# Altium schematic sheet optrons_and_mcp.SchDoc
size A3
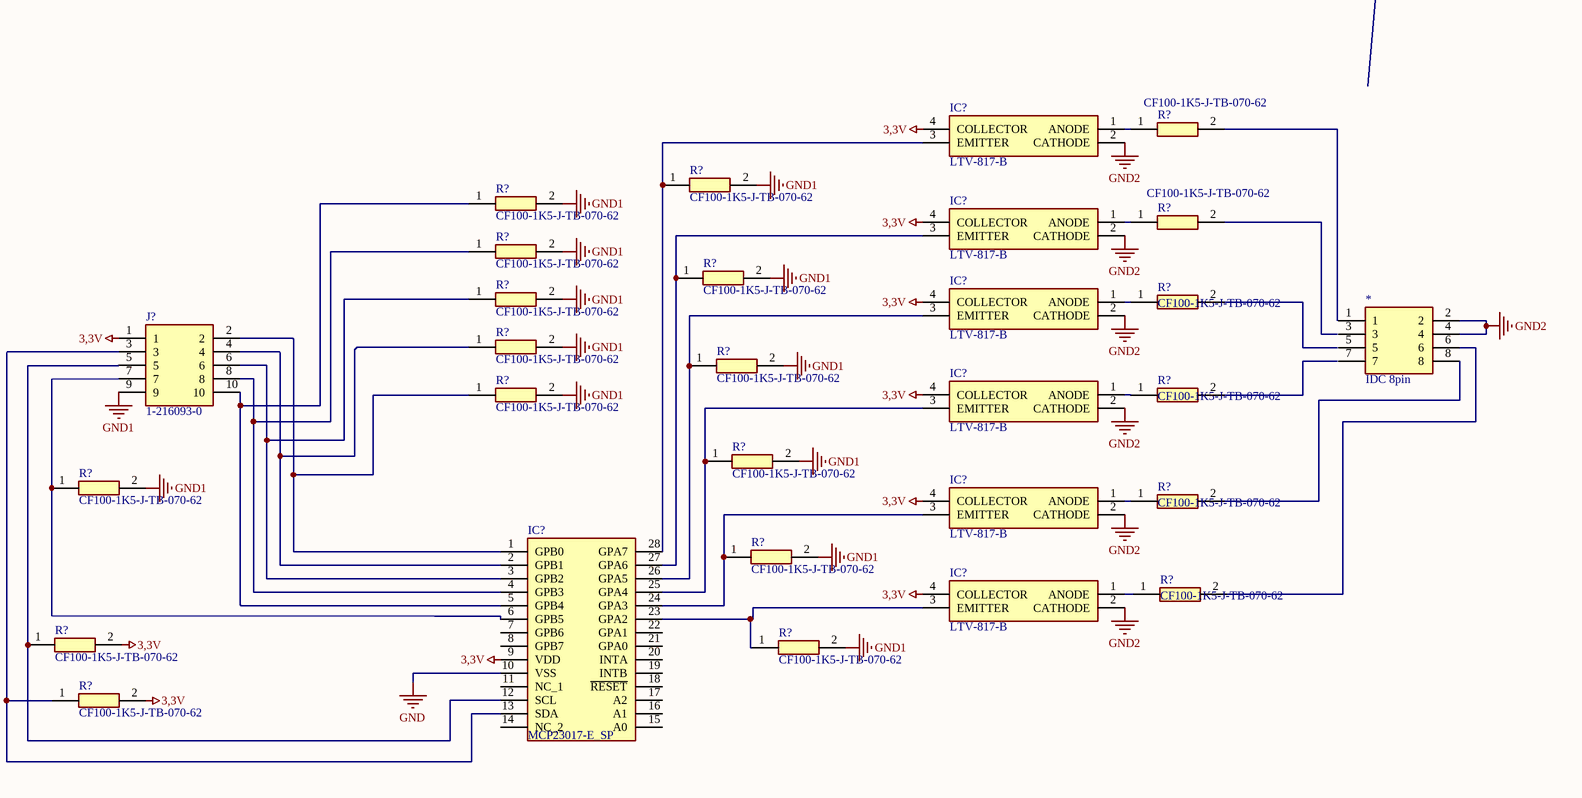
[diagram p0: optrons_and_mcp.SchDoc, bottom right]

## Parts
(Parts that share a designator on the sheet are numbered #1, #2 ... from top to bottom, then left to right.)
*  IDC 8pin
IC?#1  LTV-817-B  [DIP762W60P254L460H420Q4N]
IC?#2  LTV-817-B  [DIP762W60P254L460H420Q4N]
IC?#3  LTV-817-B  [DIP762W60P254L460H420Q4N]
IC?#4  LTV-817-B  [DIP762W60P254L460H420Q4N]
IC?#5  LTV-817-B  [DIP762W60P254L460H420Q4N]
IC?#6  MCP23017-E_SP  [DIP794W56P254L3486H508Q28N]
IC?#7  LTV-817-B  [DIP762W60P254L460H420Q4N]
J?  1-216093-0  [12160930]
R?#1  CF100-1K5-J-TB-070-62  [RESAD2700W60L1100D400]
R?#2  CF100-1K5-J-TB-070-62  [RESAD2700W60L1100D400]
R?#3  CF100-1K5-J-TB-070-62  [RESAD2700W60L1100D400]
R?#4  CF100-1K5-J-TB-070-62  [RESAD2700W60L1100D400]
R?#5  CF100-1K5-J-TB-070-62  [RESAD2700W60L1100D400]
R?#6  CF100-1K5-J-TB-070-62  [RESAD2700W60L1100D400]
R?#7  CF100-1K5-J-TB-070-62  [RESAD2700W60L1100D400]
R?#8  CF100-1K5-J-TB-070-62  [RESAD2700W60L1100D400]
R?#9  CF100-1K5-J-TB-070-62  [RESAD2700W60L1100D400]
R?#10  CF100-1K5-J-TB-070-62  [RESAD2700W60L1100D400]
R?#11  CF100-1K5-J-TB-070-62  [RESAD2700W60L1100D400]
R?#12  CF100-1K5-J-TB-070-62  [RESAD2700W60L1100D400]
R?#13  CF100-1K5-J-TB-070-62  [RESAD2700W60L1100D400]
R?#14  CF100-1K5-J-TB-070-62  [RESAD2700W60L1100D400]
R?#15  CF100-1K5-J-TB-070-62  [RESAD2700W60L1100D400]
R?#16  CF100-1K5-J-TB-070-62  [RESAD2700W60L1100D400]
R?#17  CF100-1K5-J-TB-070-62  [RESAD2700W60L1100D400]
R?#18  CF100-1K5-J-TB-070-62  [RESAD2700W60L1100D400]
R?#19  CF100-1K5-J-TB-070-62  [RESAD2700W60L1100D400]
R?#20  CF100-1K5-J-TB-070-62  [RESAD2700W60L1100D400]

## Nets
3,3V: IC?#2.4(COLLECTOR) IC?#3.4(COLLECTOR) IC?#4.4(COLLECTOR) IC?#5.4(COLLECTOR) IC?#6.9(VDD) IC?#7.4(COLLECTOR) J?.1 R?#18.2 R?#20.2
GND: IC?#6.10(VSS)
GND1: J?.9 R?#2.2 R?#3.2 R?#5.2 R?#6.2 R?#7.2 R?#9.2 R?#10.2 R?#11.2 R?#13.2 R?#14.2 R?#16.2 R?#19.2
GND2: *.2 *.4 IC?#1.2(CATHODE) IC?#2.2(CATHODE) IC?#3.2(CATHODE) IC?#4.2(CATHODE) IC?#5.2(CATHODE) IC?#7.2(CATHODE)
Net*_6: *.6 R?#17.2
Net*_8: *.8 R?#15.2
NetIC?#1_1: IC?#1.1(ANODE) R?#1.1
NetIC?#1_3: IC?#1.3(EMITTER) IC?#6.28(GPA7) R?#2.1
NetIC?#2_1: IC?#2.1(ANODE) R?#4.1
NetIC?#2_3: IC?#2.3(EMITTER) IC?#6.27(GPA6) R?#6.1
NetIC?#3_1: IC?#3.1(ANODE) R?#8.1
NetIC?#3_3: IC?#3.3(EMITTER) IC?#6.26(GPA5) R?#10.1
NetIC?#4_1: IC?#4.1(ANODE) R?#12.1
NetIC?#4_3: IC?#4.3(EMITTER) IC?#6.25(GPA4) R?#13.1
NetIC?#5_1: IC?#5.1(ANODE) R?#15.1
NetIC?#5_3: IC?#5.3(EMITTER) IC?#6.24(GPA3) R?#16.1
NetIC?#6_1: IC?#6.1(GPB0) J?.2 R?#11.1
NetIC?#6_2: IC?#6.2(GPB1) J?.4 R?#9.1
NetIC?#6_3: IC?#6.3(GPB2) J?.6 R?#7.1
NetIC?#6_4: IC?#6.4(GPB3) J?.8 R?#5.1
NetIC?#6_5: IC?#6.5(GPB4) J?.10 R?#3.1
NetIC?#6_6: IC?#6.6(GPB5) J?.7 R?#14.1
NetIC?#6_12: IC?#6.12(SCL) J?.5 R?#18.1
NetIC?#6_13: IC?#6.13(SDA) J?.3 R?#20.1
NetIC?#6_23: IC?#6.23(GPA2) IC?#7.3(EMITTER) R?#19.1
NetIC?#7_1: IC?#7.1(ANODE) R?#17.1

Not connected (* = marked no-connect by the designer): * 1 3 5 7; IC?#1 4(COLLECTOR); IC?#6 7(GPB6) 8(GPB7) 11(NC_1) 14(NC_2) 15(A0) 16(A1) 17(A2) 18(~{RESET}) 19(INTB) 20(INTA) 21(GPA0) 22(GPA1); R?#1 2; R?#4 2; R?#8 2; R?#12 2

## Notes on the sheet
- Labels drawn without touching a wire or pin: 3,3V

## Library data of the parts
IC?#1-IC?#5 IC?#7 = LTV-817-B: Integrated Circuit; Manufacturer_Name: Lite-On; Datasheet Link: http://optoelectronics.liteon.com/upload/download/DS-70-96-0016/LTV-8X7%20series%20201610%20.pdf; Height: 4.2mm; Manufacturer_Part_Number: LTV-817-B; Mouser Part Number: N/A; Mouser Price/Stock: https://www.mouser.co.uk/ProductDetail/Lite-On/LTV-817-B?qs=5Clb0NIqk7HzP4M9tIz87Q%3D%3D; Arrow Part Number: LTV-817-B; Arrow Price/Stock: https://www.arrow.com/en/products/ltv-817-b/lite-on-technology
IC?#6 = MCP23017-E_SP: Integrated Circuit; Manufacturer_Name: Microchip; Manufacturer_Part_Number: MCP23017-E/SP; Datasheet Link: http://docs-emea.rs-online.com/webdocs/137e/0900766b8137eed4.pdf; Height: 5.08mm; Mouser Part Number: 579-MCP23017-E/SP; Mouser Price/Stock: https://www.mouser.co.uk/ProductDetail/Microchip-Technology/MCP23017-E-SP?qs=usxtMOJb1RyESXZDw7ia5A%3D%3D; Arrow Part Number: MCP23017-E/SP; Arrow Price/Stock: https://www.arrow.com/en/products/mcp23017-esp/microchip-technology
J? = 1-216093-0: Connector; Manufacturer_Name: TE Connectivity; Datasheet Link: https://componentsearchengine.com/Datasheets/2/1-216093-0.pdf; Height: 6.8mm; Manufacturer_Part_Number: 1-216093-0; Mouser Part Number: 571-1-216093-0; Mouser Price/Stock: https://www.mouser.co.uk/ProductDetail/TE-Connectivity/1-216093-0?qs=m7RwewakXS%2F9HSJylQnIAQ%3D%3D; Arrow Part Number: 1-216093-0; Arrow Price/Stock: https://www.arrow.com/en/products/1-216093-0/te-connectivity
R?#1-R?#20 = CF100-1K5-J-TB-070-62: Resistor; Manufacturer_Name: HKR; Datasheet Link: http://www.hkresistors.com/img2015/CF_BULK_PACKING_DATA_SHEET_2015_Copper_WIRE.pdf; Manufacturer_Part_Number: CF100-1K5-J-TB-070-62